# EAGLE design Cable Tester (EAGLE 9.6.2)
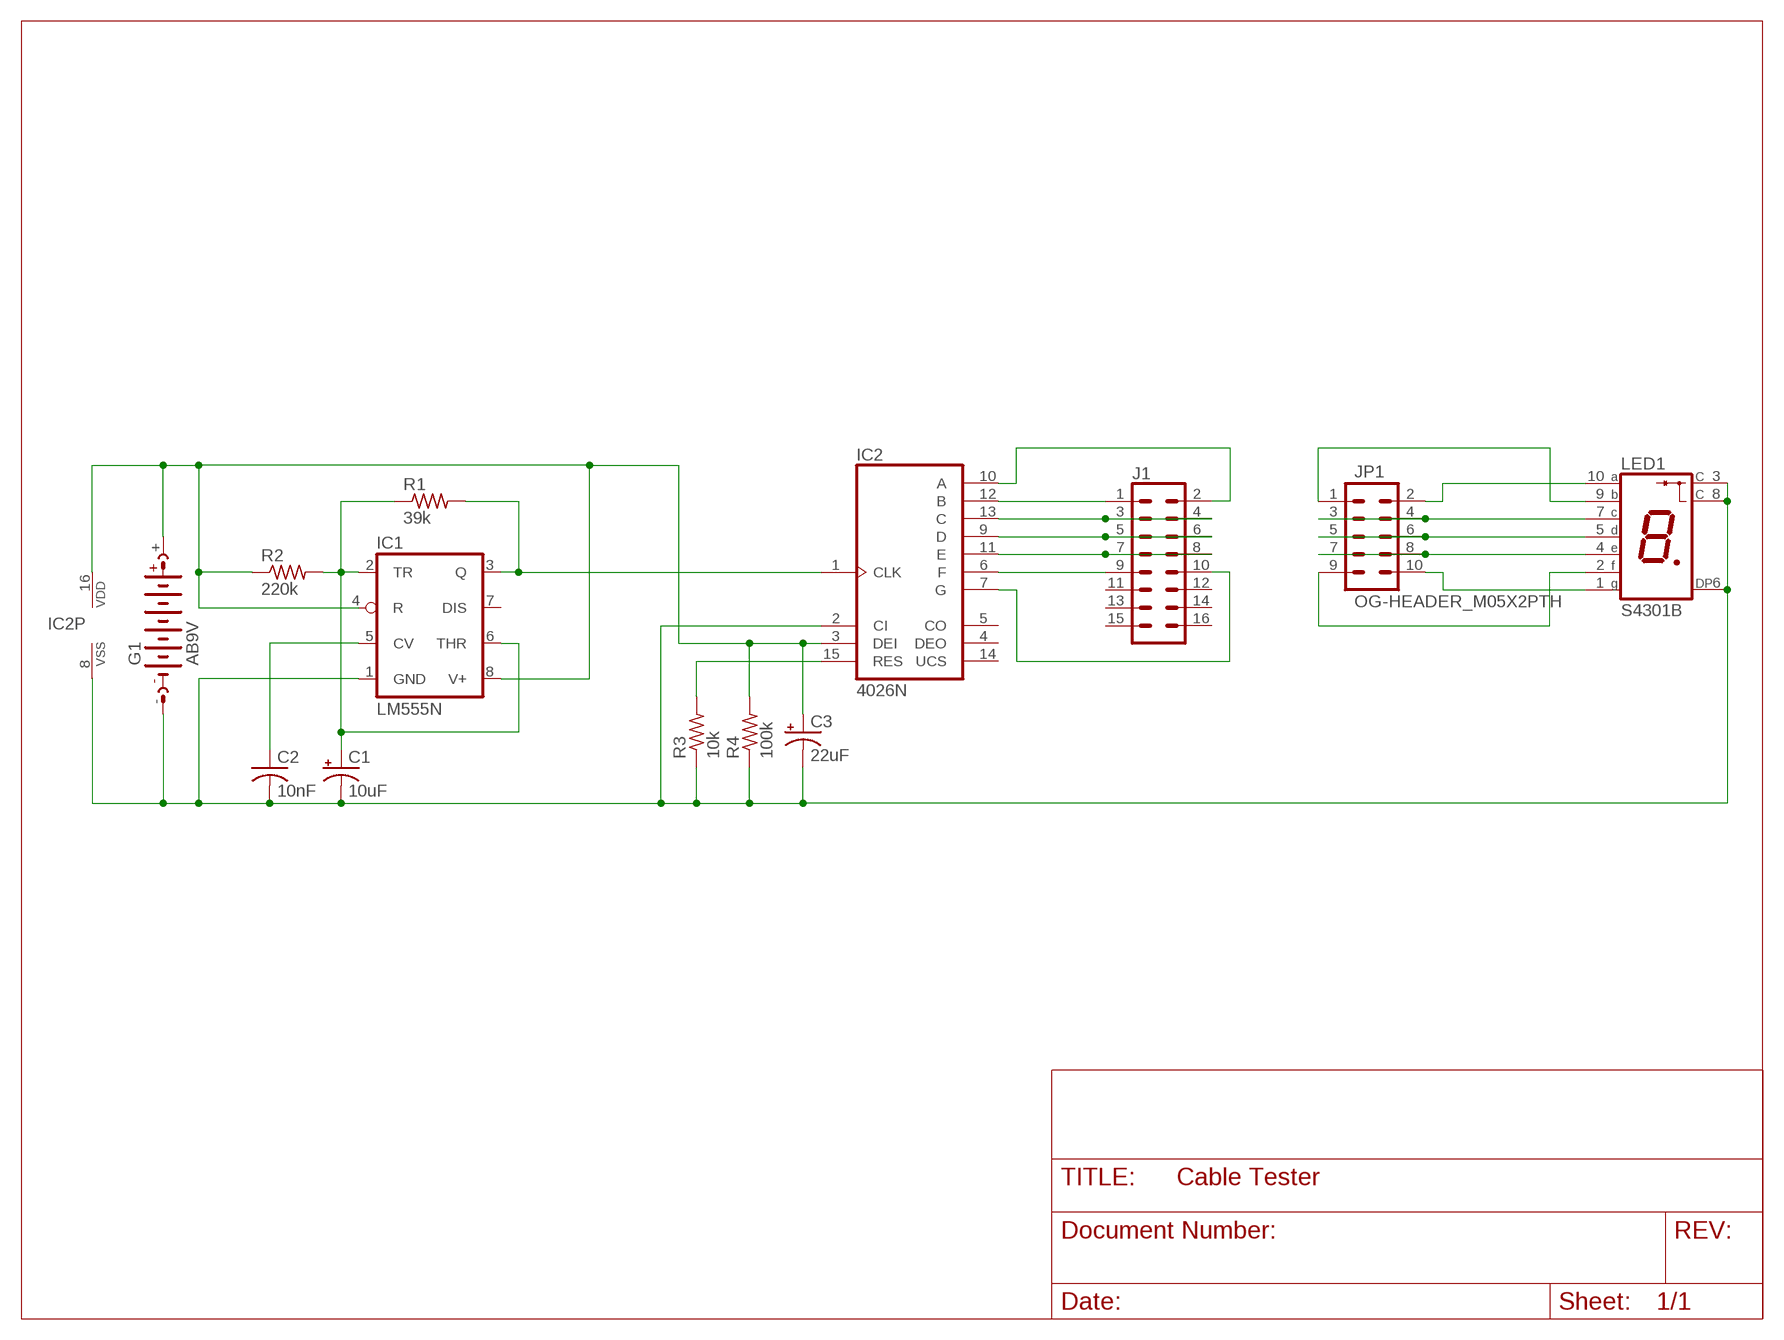
[diagram p0: schematic, sheet 1]

## Parts
C1  10uF  RCL_CPOL-USE5-5  [RCL_E5-5]
C2  10nF  RCL_C-US050-055X075  [RCL_C050-055X075]
C3  22uF  RCL_CPOL-USE5-5  [RCL_E5-5]
G1  AB9V  [AB9V]
IC1  LM555N  [DIL08]
IC2  4026N  [DIL16]
J1  CONN_08X2_HEADER  [2X8]
JP1  OG-HEADER_M05X2PTH  [OG-HEADER_AVR_ICSP]
LED1  S4301B  [S4301B]
R1  39k  RESISTOR_R-US_0309/10  [RESISTOR_0309/10]
R2  220k  RESISTOR_R-US_0309/10  [RESISTOR_0309/10]
R3  10k  RESISTOR_R-US_0309/10  [RESISTOR_0309/10]
R4  100k  RESISTOR_R-US_0309/10  [RESISTOR_0309/10]

## Nets
N$1: C1.+ IC1.2(TR) IC1.6(THR) R1.1 R2.2
N$2: IC1.3(Q) IC2.1(CLK) R1.2
N$3: C2.1 IC1.5(CV)
N$4: IC2.15(RES) R3.2
N$5: IC2.10(A) J1.2
N$6: IC2.12(B) J1.1
N$7: IC2.13(C) J1.3 J1.4
N$8: IC2.9(D) J1.5 J1.6
N$9: IC2.11(E) J1.7 J1.8
N$10: IC2.6(F) J1.9
N$11: IC2.7(G) J1.10
N$12: JP1.2 LED1.10(A)
N$13: JP1.1 LED1.9(B)
N$14: JP1.3 JP1.4 LED1.7(C)
N$15: JP1.5 JP1.6 LED1.5(D)
N$16: JP1.7 JP1.8 LED1.4(E)
N$17: JP1.10 LED1.1(G)
N$18: JP1.9 LED1.2(F)
N$19: C3.+ G1.+ IC1.4(R) IC1.8(V+) IC2.3(DEI) IC2.16(VDD) R2.1 R4.2
N$20: C1.- C2.2 C3.- G1.- IC1.1(GND) IC2.2(CI) IC2.8(VSS) LED1.3(C) LED1.6(DP) LED1.8(C) R3.1 R4.1
Unconnected: IC1.7(DIS) IC2.4(DEO) IC2.5(CO) IC2.14(UCS) J1.11 J1.12 J1.13 J1.14 J1.15 J1.16

## Library data of the parts
C1 C3 = my-library:RCL_CPOL-US: POLARIZED CAPACITOR, American symbol
C2 = my-library:RCL_C-US: CAPACITOR, American symbol
G1 = battery:AB9V: 9-V BATTERY CLIP
IC1 = linear:*555: TIMER
IC2 = 40xx:4026: Decade COUNTER/DIVIDER, 7-seg. outputs
J1 = my-library:CONN_08X2: Multi connection point. Often used as Generic Header-pin footprint for 0.1 inch spaced/style header connections You can populate with any combo of single row headers, but if you'd like an exact match, check this: Header - 2x8 (Male, 0.1") <https://www.sparkfun.com/products/13156> (PRT-13156) On any of the 0.1 inch spaced packages, you can populate with these: Break Away Headers - Straight <https://www.sparkfun.com/products/116> (PRT-00116) Break Away Male Headers - Right Angle <https://www.sparkfun.com/products/553> (PRT-00553) Female Headers <https://www.sparkfun.com/products/115> (PRT-00115) Break Away Headers - Machine Pin <https://www.sparkfun.com/products/117> (PRT-00117) Break Away Female Headers - Swiss Machine Pin <https://www.sparkfun.com/products/743> (PRT-00743)
JP1 = my-library:OG-HEADER_M05X2: Header 5x2 Standard 10-pin dual row 0.1" header. Commonly used with AVR-ISP. Use with Spark Fun Electronics SKU: PRT-00778
LED1 = led-7-segment:S4301B: Single Digit Seven-Segment Display (cathode common) Source: LITEON .. S4301B.pdf; OC_FARNELL: unknown; OC_NEWARK: unknown
R1-R4 = my-library:RESISTOR_R-US_: RESISTOR, American symbol

## Board
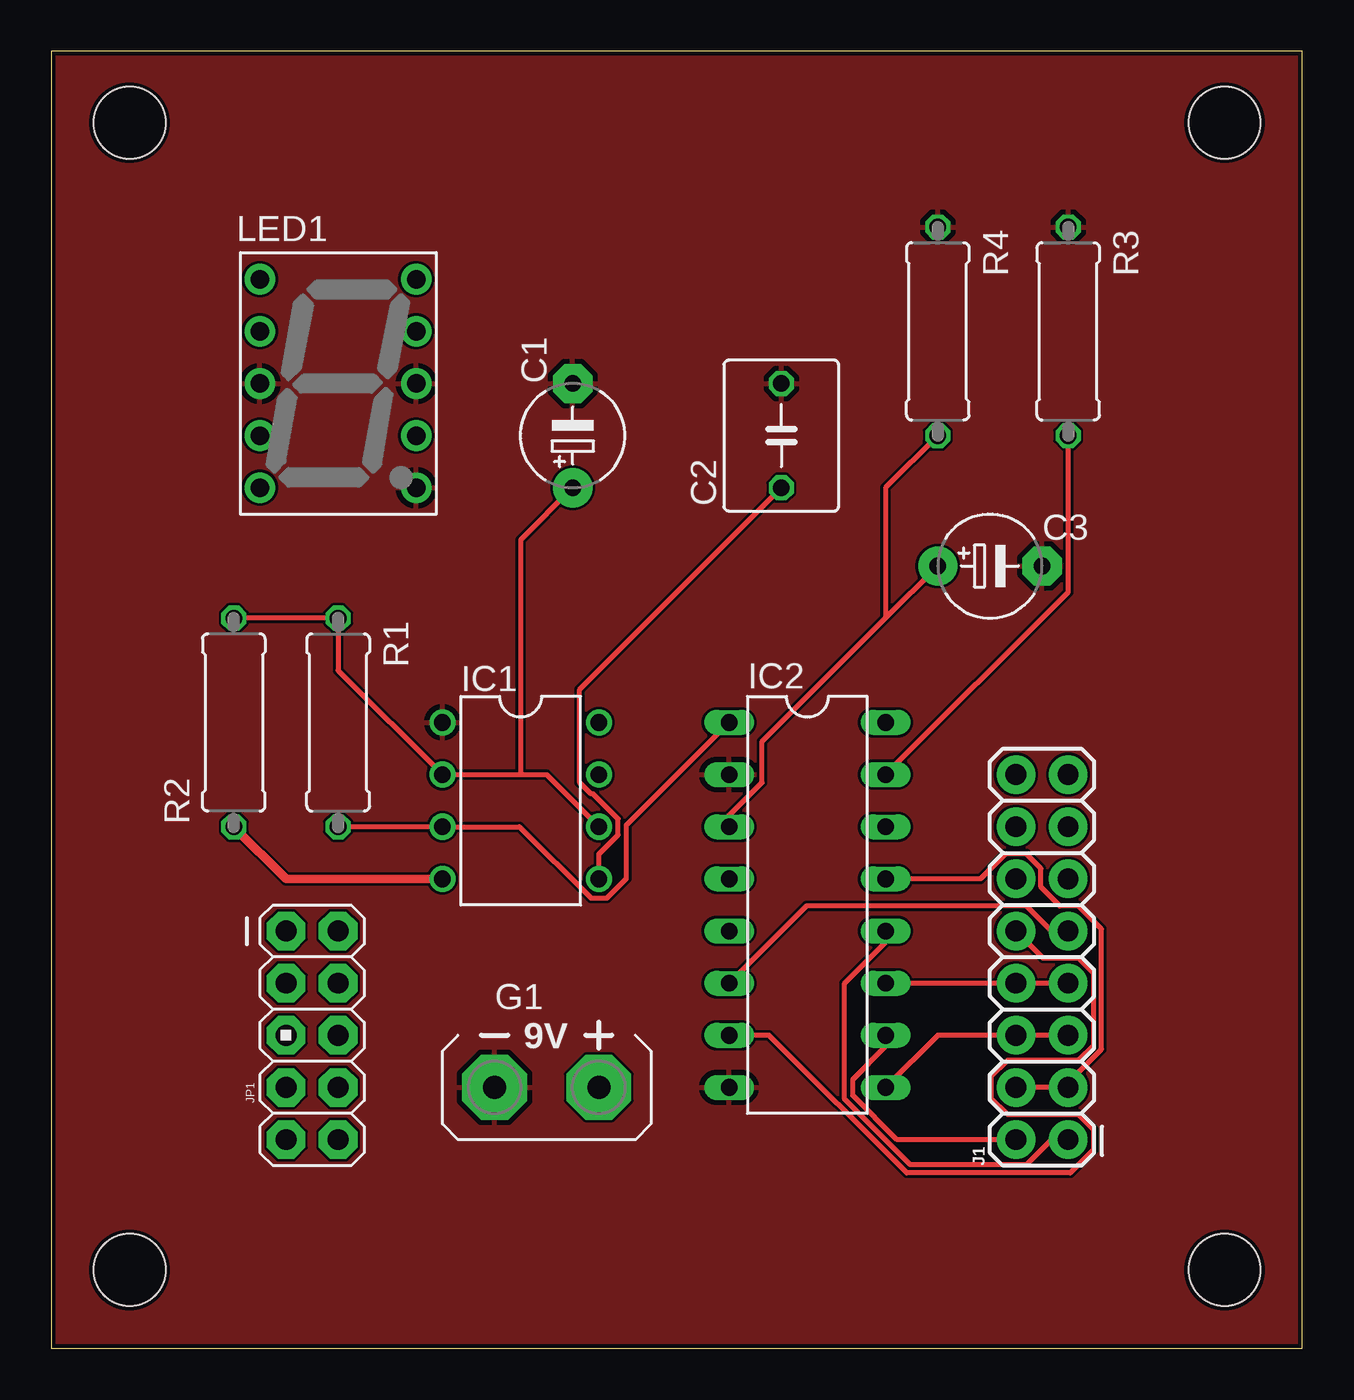
[diagram p1: board, top side]
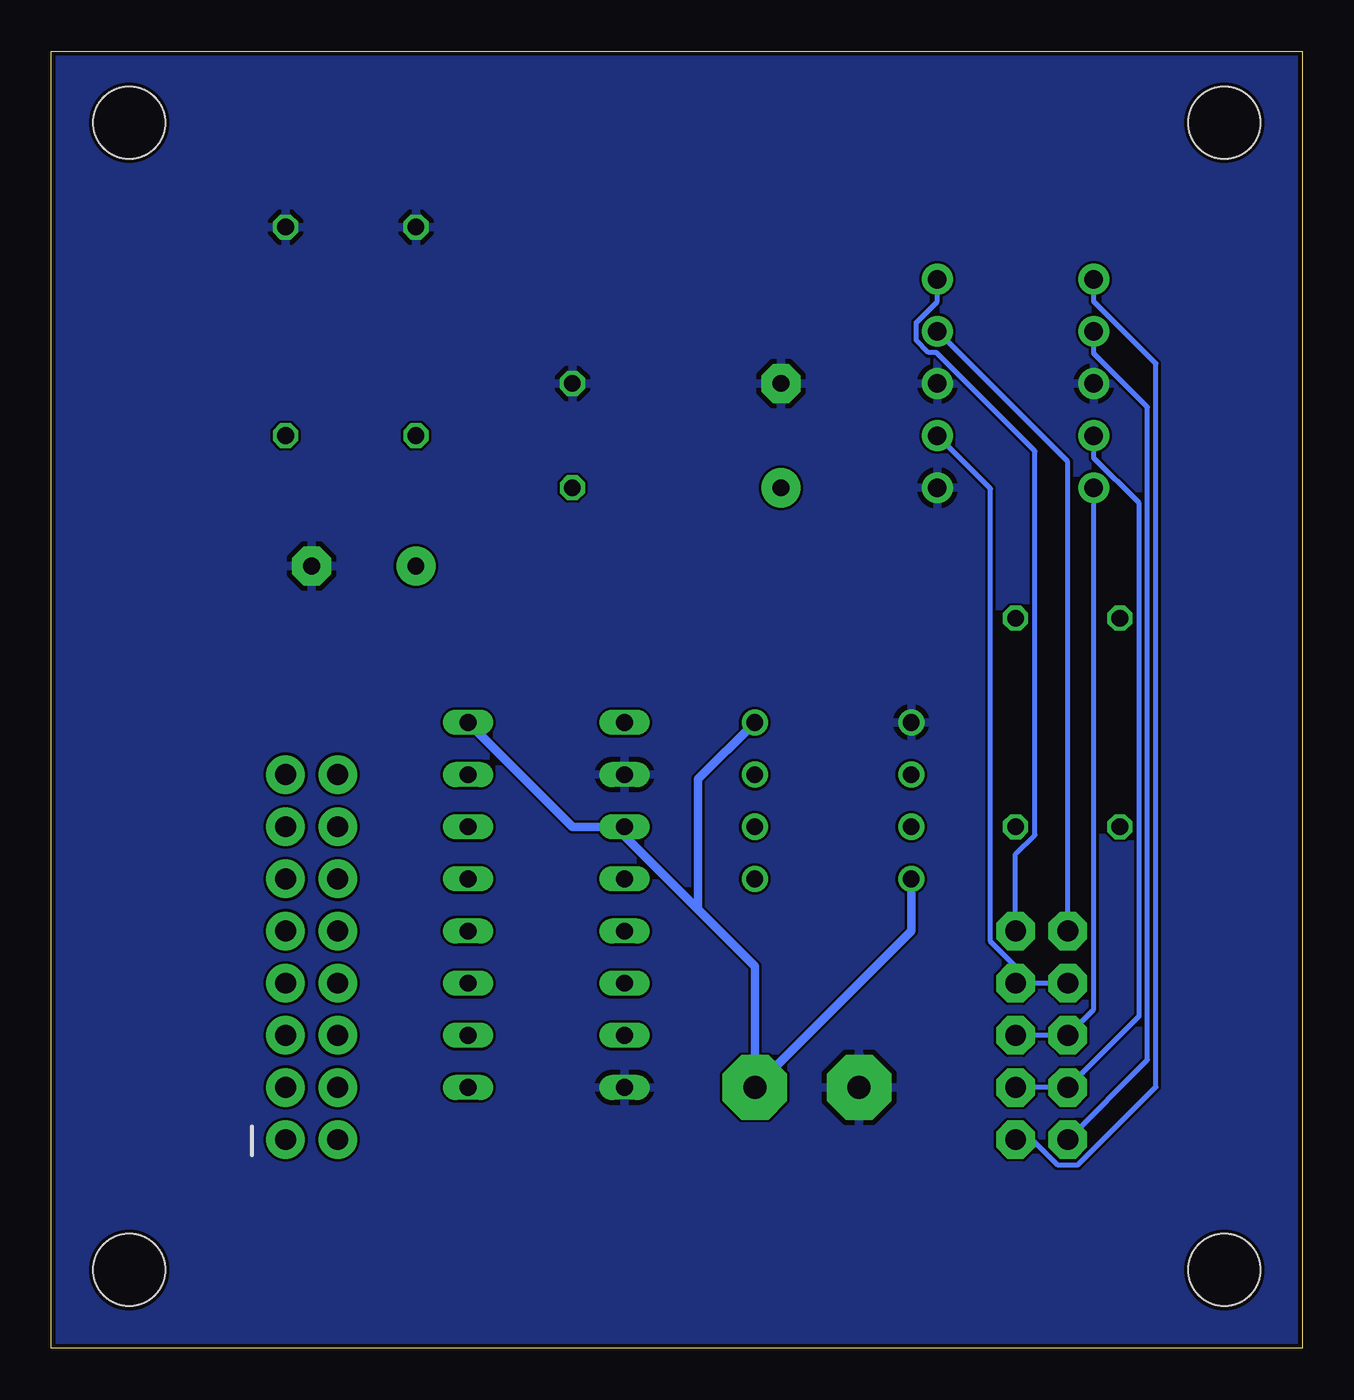
[diagram p2: board, bottom side, seen from below]

Size 60.94 x 63.17 mm. Coordinates in mm from the lower left corner, seen from the top.
Outline: 0,0 60.94,0 60.94,63.17 0,63.17 0,0
Copper layers (1*16): Top 0.035559375mm / dielectric 1.6mm / Bottom 0.035559375mm
Design rules "jlcpcb2layer": minimum track width 5mil, minimum drill 12mil, track to track 5mil, track to pad 5mil, pad to pad 5mil, via to via 5mil, smd to smd 5mil, copper to edge 8mil, drill to drill 6mil, minimum pad ring 5mil, minimum via ring 3mil, stop-mask expansion 2.5mil, vias tented up to drill 0mil, thermal gap 10mil
Holes 3.5 mm at 57.15,59.69 3.81,59.69 3.81,3.81 57.15,3.81

### Footprints (pad centres in the part's own frame; a part is rotated, then mirrored left to right if it is on the bottom)
RCL_E5-5 = drill 0.813 pad 1.905: + -2.54,0 | drill 0.813 pad 1.905 octagon: - 2.54,0
RCL_C050-055X075 = drill 0.813 octagon: 1 -2.54,0; 2 2.54,0
AB9V = drill 1.118 pad 3.15 octagon: + 0,2.54; - 0,-2.54
DIL08 = drill 0.813 pad 1.27: 1 -3.81,-3.81; 2 -1.27,-3.81; 3 1.27,-3.81; 4 3.81,-3.81; 5 3.81,3.81; 6 1.27,3.81; 7 -1.27,3.81; 8 -3.81,3.81
DIL16 = drill 0.813 long: 1 -8.89,-3.81; 2 -6.35,-3.81; 3 -3.81,-3.81; 4 -1.27,-3.81; 5 1.27,-3.81; 6 3.81,-3.81; 7 6.35,-3.81; 8 8.89,-3.81; 9 8.89,3.81; 10 6.35,3.81; 11 3.81,3.81; 12 1.27,3.81; 13 -1.27,3.81; 14 -3.81,3.81; 15 -6.35,3.81; 16 -8.89,3.81
2X8 = drill 1.016 pad 1.88: 1 0,0; 2 0,2.54; 3 2.54,0; 4 2.54,2.54; 5 5.08,0; 6 5.08,2.54; 7 7.62,0; 8 7.62,2.54; 9 10.16,0; 10 10.16,2.54; 11 12.7,0; 12 12.7,2.54; 13 15.24,0; 14 15.24,2.54; 15 17.78,0; 16 17.78,2.54
OG-HEADER_AVR_ICSP = drill 1.016 pad 1.88 octagon: 1 -1.27,5.08; 2 1.27,5.08; 3 -1.27,2.54; 4 1.27,2.54; 5 -1.27,0; 6 1.27,0; 7 -1.27,-2.54; 8 1.27,-2.54; 9 -1.27,-5.08; 10 1.27,-5.08
S4301B = drill 0.9 pad 1.5: 1 -3.81,5.08; 2 -3.81,2.54; 3 -3.81,0; 4 -3.81,-2.54; 5 -3.81,-5.08; 6 3.81,-5.08; 7 3.81,-2.54; 8 3.81,0; 9 3.81,2.54; 10 3.81,5.08
RESISTOR_0309/10 = drill 0.813 octagon: 1 -5.08,0; 2 5.08,0

### Placement (x,y rotation side)
C1  25.4,44.45 90 top
C2  35.56,44.45 90 top
C3  45.72,38.1 0 top
G1  24.13,12.7 270 top
IC1  22.86,26.67 270 top
IC2  36.83,21.59 270 top
J1  49.53,10.16 90 top
JP1  12.7,15.24 0 top
LED1  13.97,46.99 0 top
R1  13.97,30.48 270 top
R2  8.89,30.48 90 top
R3  49.53,49.53 270 top
R4  43.18,49.53 270 top

### Tracks (layer width: path | path; a pad name or v marks a point on that pad's centre or on a via)
N$1
  Top 0.254: 22.86,27.94 IC1.2 13.97,33.02 R1.1 R2.2 | 22.86,27.94 24.13,27.94 IC1.6 | C1.+ 22.86,39.37 22.86,27.94
N$2
  Top 0.254: R1.2 IC1.3 22.8,25.4 26.28,21.92 27.06,21.92 28.02,22.88 28.02,25.48 IC2.1
N$3
  Top 0.254: IC1.5 26.67,24.07 27.61,25.01 27.61,25.79 26.4,27 26.28,27 25.73,27.55 25.73,32.08 C2.1
N$4
  Top 0.254: IC2.15 49.53,36.83 R3.2
N$5
  Top 0.254: IC2.10 40.64,14.69 39.04,13.09 39.04,12.31 41.19,10.16 J1.2
N$6
  Top 0.254: IC2.12 40.64,19.77 38.63,17.76 38.63,12.14 41.84,8.94 47.49,8.94 48.71,10.16 J1.1
N$7
  Top 0.254: J1.4 J1.3 49.53,12.94 51.16,14.57 51.16,20.42 50.03,21.54 49.13,21.54 48.21,22.46 48.21,23.37 47.49,24.08 46.48,24.08 45.27,22.86 IC2.13
N$8
  Top 0.254: J1.5 J1.6 43.18,15.24 IC2.9
N$9
  Top 0.254: J1.7 J1.8 IC2.11
N$10
  Top 0.254: J1.9 48.71,20.32 47.49,21.54 36.78,21.54 IC2.6
N$11
  Top 0.254: IC2.7 34.96,15.24 41.67,8.53 49.63,8.53 50.75,9.66 50.75,10.66 50.03,11.38 46.59,11.38 45.77,12.2 45.77,13.21 46.59,14.02 50.03,14.02 50.75,14.73 50.75,18.29 50.03,19 48.31,19 J1.10
N$12
  Bottom 0.254: JP1.2 13.97,24.07 13.03,25.01 13.03,43.7 17.84,48.5 18.21,48.5 18.81,49.1 18.81,49.96 17.78,50.99 LED1.10
N$13
  Bottom 0.254: JP1.1 11.43,43.18 LED1.9
N$14
  Bottom 0.254: JP1.3 JP1.4 13.97,18.6 15.19,19.81 15.19,41.86 LED1.7
N$15
  Bottom 0.254: JP1.6 JP1.5 10.16,16.51 LED1.5
N$16
  Bottom 0.254: JP1.8 JP1.7 7.95,16.18 7.95,41.16 10.16,43.37 LED1.4
N$17
  Bottom 0.254: LED1.1 10.16,50.99 7.14,47.96 7.14,12.73 10.93,8.94 11.94,8.94 13.15,10.16 JP1.10
N$18
  Bottom 0.254: LED1.2 10.16,48.45 7.54,45.83 7.54,14.05 JP1.9
N$19
  Top 0.254: IC2.3 33.02,25.95 34.62,27.55 34.62,29.54 40.64,35.56 | 40.64,35.56 C3.+ | R4.2 40.64,41.91 40.64,35.56
  Top 0.406: IC1.4 11.43,22.86 R2.1
  Bottom 0.406: 29.43,21.37 26.67,18.61 G1.+ 19.05,20.32 IC1.4 | IC1.8 29.43,27.72 29.43,21.37 | 29.43,21.37 33.02,24.96 IC2.3 35.56,25.4 IC2.16
N$20
  pour Top: 0,0 0,63.5 60.96,63.5 60.96,0
  pour Bottom: 0,0 0,63.5 60.96,63.5 60.96,0